# EAGLE design tweeq-Stamp_Prox_VCNL4020 (EAGLE 7.2.0)
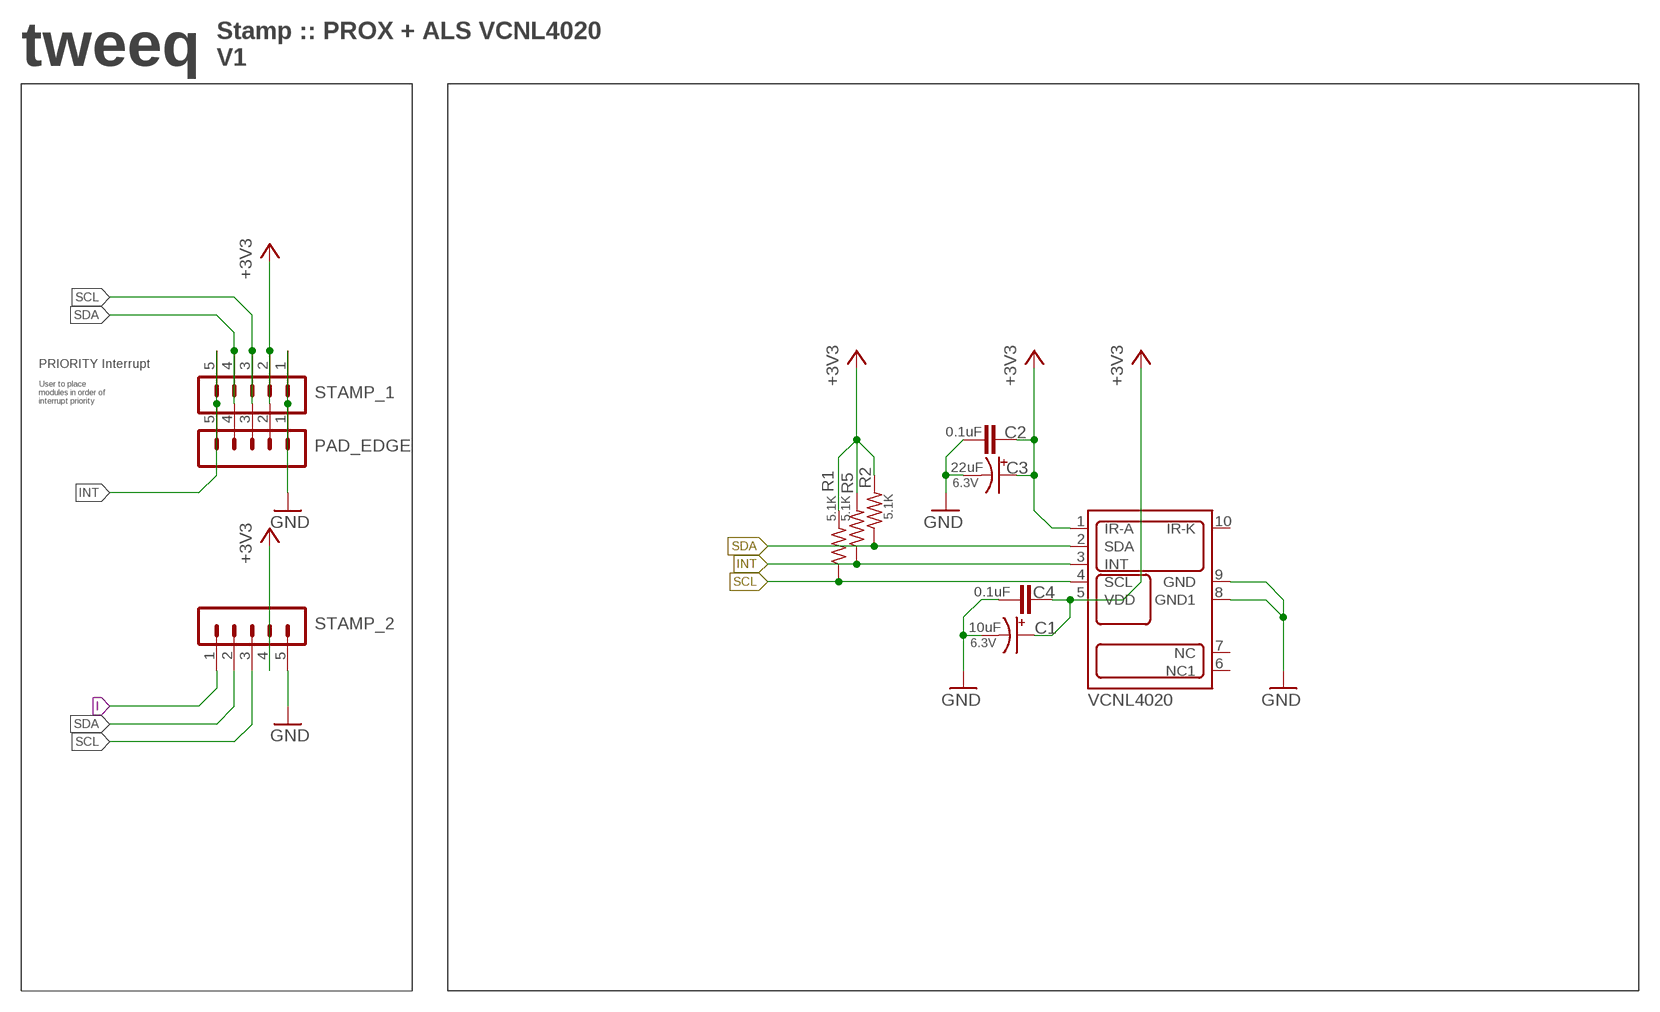
[diagram p0: schematic, sheet 1]

## Parts
C1  10uF  CPOL-USSMCZ  [SMC_Z]
C2  0.1uF  C-EUC0402K  [C0402K]
C3  22uF  CPOL-USSMCZ  [SMC_Z]
C4  0.1uF  C-EUC0402K  [C0402K]
PAD_EDGE  M05-11.5MM-PAD  [1X05-1.5MM-PAD]
R1  5.1K  R-US_R0402  [R0402]
R2  5.1K  R-US_R0402  [R0402]
R5  5.1K  R-US_R0402  [R0402]
STAMP_1  M05-1STAMP  [1X05-1.5MM-STAMP]
STAMP_2  M05-1STAMP  [1X05-1.5MM-STAMP]
VCNL4020  VCNL4020  [VCNL4020]

## Nets
+3V3: C1.+ C2.2 C3.+ C4.2 PAD_EDGE.2 R1.2 R2.2 R5.2 STAMP_1.2 STAMP_2.4 VCNL4020.1(IR-A) VCNL4020.5(VDD)
GND: C1.- C2.1 C3.- C4.1 PAD_EDGE.1 STAMP_1.1 STAMP_2.5 VCNL4020.8(GND1) VCNL4020.9(GND)
I: STAMP_2.1
INT: PAD_EDGE.5 R5.1 STAMP_1.5 VCNL4020.3(INT)
SCL: PAD_EDGE.3 R1.1 STAMP_1.3 STAMP_2.3 VCNL4020.4(SCL)
SDA: PAD_EDGE.4 R2.1 STAMP_1.4 STAMP_2.2 VCNL4020.2(SDA)
Unconnected: VCNL4020.6(NC1) VCNL4020.7(NC) VCNL4020.10(IR-K)

## Notes on the sheet
- tweeq
- Stamp :: PROX + ALS VCNL4020
  V1
- PRIORITY Interrupt
- User to place 
  modules in order of 
  interrupt priority
- 6.3V
- 6.3V

## Library data of the parts
C1 C3 = AISCube:CPOL-US: POLARIZED CAPACITOR, American symbol
C2 C4 = AISCube:C-EU: CAPACITOR, European symbol
PAD_EDGE STAMP_1 STAMP_2 = AISCube:M05-1: PIN HEADER Standard 0.1" header pin 5 pins - 1 way
R1 R2 R5 = rcl:R-US_: RESISTOR, American symbol
VCNL4020 = AISCube:VCNL4020: Vishay VCNL4020 Fully Integrated Proximity and Ambient Light Sensor with Infrared Emitter, I2C Interface, and Interrupt Function Features: • Dimensions (L x W x H in mm): 4.90 x 2.40 x 0.83 • Integrated modules: infrared emitter (IRED), ambient light sensor (ALS-PD), proximity sensor (PD), and signal conditioning IC • Interrupt function • Supply voltage range VDD: 2.5 V to 3.6 V • Supply voltage range IR anode: 2.5 V to 5 V • Communication via I2C interface

## Board
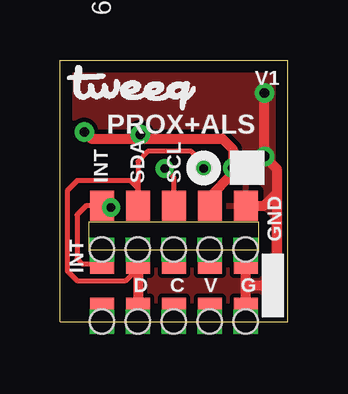
[diagram p1: board, top side]
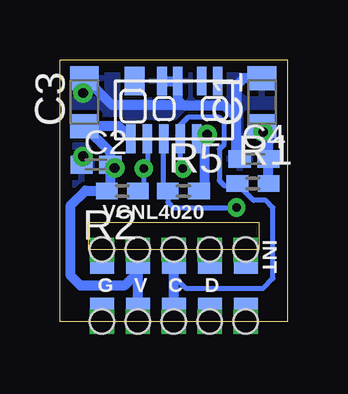
[diagram p2: board, bottom side, seen from below]

Size 9.5 x 10.9 mm. Coordinates in mm from the lower left corner, seen from the top.
Outline: 0,0 0,10.9 9.5,10.9 9.5,0 0,0
Outline: 1.2,3 8.3,3 8.3,4.15 1.2,4.15 1.2,3
Copper layers (1*16): Top 0.0356mm / dielectric 1.5011mm / Bottom 0.0356mm
Design rules "AISCube": minimum track width 7mil, minimum drill 14mil, track to track 7mil, track to pad 7mil, pad to pad 7mil, via to via 7mil, smd to smd 0mil, copper to edge 20mil, drill to drill 8mil, minimum pad ring 10mil, minimum via ring 8mil, stop-mask expansion 4mil, vias tented up to drill 32mil, thermal gap 10mil

### Footprints (pad centres in the part's own frame; a part is rotated, then mirrored left to right if it is on the bottom)
SMC_Z = smd 1 x 1.2: + -1,0; - 1,0
C0402K = smd 0.925 x 0.74: 1 -0.6,0; 2 0.6,0
1X05-1.5MM-PAD = smd 1 x 1.25: 1 3,0.33; 2 1.5,0.33; 3 0,0.33; 4 -1.5,0.33; 5 -3,0.33
R0402 = smd 0.9 x 0.7: 1 -0.65,0; 2 0.65,0
1X05-1.5MM-STAMP = drill 0.5 pad 1 square: 1 -3,0; 2 -1.5,0; 3 0,0; 4 1.5,0; 5 3,0 | smd 1 x 0.6: P$1 -3,0.7; P$2 -1.5,0.7; P$3 0,0.7; P$4 1.5,0.7; P$5 3,0.7 | smd 1 x 0.6 bottom: P$6 -3,0.7; P$7 -1.5,0.7; P$8 0,0.7; P$9 1.5,0.7; P$10 3,0.7 | hole 1: -3,0; -1.5,0; 0,0; 1.5,0; 3,0
VCNL4020 = smd 0.4 x 1.2: 1 0.655,0; 2 1.34,0; 3 2.025,0; 4 2.71,0; 5 3.395,0; 6 4.28,2.4; 7 3.6,2.4; 8 2.6,2.4; 9 1.95,2.4 | smd 0.83 x 1.2: 10 0.8,2.4

### Placement (x,y rotation side)
C1  1.07,9.15 90 bottom
C2  7.99,6.54 0 bottom
C3  8.48,9.15 90 bottom
C4  1.4,6.78 0 bottom
PAD_EDGE  4.75,4.49 0 top
R1  1.44,5.76 0 bottom
R2  6.9,5.44 180 bottom
R5  4.35,5.44 0 bottom
STAMP_1  4.75,3 180 top
STAMP_2  4.75,0 0 top
U$1  [TWEEQ-LOGO-S]  0.3,8.8 0 top
VCNL4020  7.19,7.62 0 bottom

### Tracks (layer width: path | path; a pad name or v marks a point on that pad's centre or on a via)
+3V3  (via drill 0.41)
  Top 0.406: v3.35,7.8 3.63,7.62 | 3.63,7.62 6.78,7.62 7.21,7.19 v7.21,6.4 7.21,6.17 6.25,5.21 PAD_EDGE.2 | v1.02,7.9 1.29,7.62 3.63,7.62
  Bottom 0.406: R1.2 C4.2 0.8,7.88 C1.+ 1.07,7.95 v1.02,7.9 | 6.53,7.4 VCNL4020.1 7.06,8.15 C3.+ 7.39,7.06 C2.2 | v3.35,7.8 3.63,7.62 VCNL4020.5 3.45,7.28 3.45,5.68 R5.2 | STAMP_2.4 STAMP_1.2 6.25,2.06 6.81,1.5 8.64,1.5 9.04,1.91 9.04,4.85 8.43,5.46 7.57,5.46 R2.2 7.39,5.6 C2.2 | C2.2 7.35,6.54 v7.21,6.4
GND  (via drill 0.41)
  Top 0.406: STAMP_2.5 7.75,1.4 | 7.75,1.4 STAMP_1.1 | 9.04,5.36 9.04,6.38 v8.53,6.88 v8.53,9.53 | 9.04,5.36 9.04,2.01 8.53,1.5 7.85,1.5 7.75,1.4 | PAD_EDGE.1 8.5,4.82 9.04,5.36
  Bottom 0.406: VCNL4020.9 VCNL4020.8 4.59,9.24 4.37,9.02 | 4.37,9.02 2.64,9.02 2.13,8.51 | 4.37,9.02 7.32,9.02 8.44,10.15 C3.- 8.38,9.68 v8.53,9.53 | C2.1 8.53,6.58 v8.53,6.88 | C4.1 2.13,6.91 2.13,8.51 | C1.- 1.82,10.15 2.13,9.83 2.13,8.51
  pour Top: 0.2,10.7 9.3,10.7 9.3,0.2 0.2,0.2
  pour Bottom: 0.2,10.7 9.3,10.7 9.3,0.2 0.2,0.2
INT  (via drill 0.36)
  Top 0.203: STAMP_1.5 1.75,2.54 1.63,2.41 0.91,2.41 0.71,2.62 0.71,4.45 1.09,4.82 PAD_EDGE.5 1.96,4.82 v2.13,4.75
  Bottom 0.203: VCNL4020.3 5.18,7.6 5.18,5.62 R5.1 5,4.97 4.78,4.75 v2.13,4.75
SCL  (via drill 0.36)
  Top 0.203: PAD_EDGE.3 4.75,6 v4.37,6.38
  Bottom 0.203: v4.37,6.38 4.48,6.49 VCNL4020.4 4.47,8.21 4.17,8.51 2.85,8.51 2.64,8.31 2.64,7.39 2.85,7.19 2.85,5.87 2.64,5.67 2.21,5.67 R1.1 | R1.1 2.43,5.55 | STAMP_1.3 4.75,1.88 4.27,1.4 1.02,1.4 0.61,1.8 0.61,4.75 0.91,5.06 1.42,5.06 2.09,5.73 R1.1
  Bottom 0.406: STAMP_2.3 STAMP_1.3
SDA  (via drill 0.36)
  Top 0.203: v5.99,6.38 5.99,6.58 5.49,7.09 3.66,7.09 3.25,6.68 PAD_EDGE.4 3.25,5.57 2.95,5.87 0.71,5.87 0.3,5.46 0.3,2.11 0.71,1.7 2.74,1.7 3.25,2.21 STAMP_1.4
  Top 0.406: STAMP_1.4 STAMP_2.2
  Bottom 0.203: VCNL4020.2 5.85,6.52 v5.99,6.38 5.99,5.69 R2.1

### Text on the board
tPlace: V1 | PROX+ALS | INT | SDA | SCL | GND | INT | D | C | V | G
bPlace: VCNL4020 | INT | D | C | V | G
tNames: 6V-9V DC | ON
bNames: Breadboard | V-Reg | Module